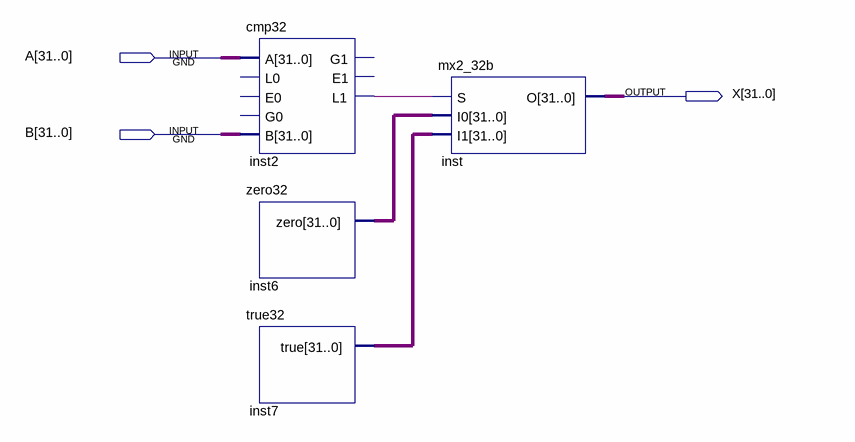
[diagram p0: schematic sheet]
// Quartus schematic sltu32.bdf as structural Verilog: 4 symbols, 3 pins
module sltu32 (
  input  [31:0] A,
  input  [31:0] B,
  output [31:0] X
);

  wire inst2_l1;
  wire [31:0] inst6_zero, inst7_true;

  cmp32 inst2 (.A(A), .B(B), .L1(inst2_l1));  // open: L0, E0, G0, G1, E1
  zero32 inst6 (.zero(inst6_zero));
  true32 inst7 (.true(inst7_true));
  mx2_32b inst (.S(inst2_l1), .I0(inst6_zero), .I1(inst7_true), .O(X));
endmodule
